# EAGLE design ds-8_clone_v1.1 (EAGLE 5.10)
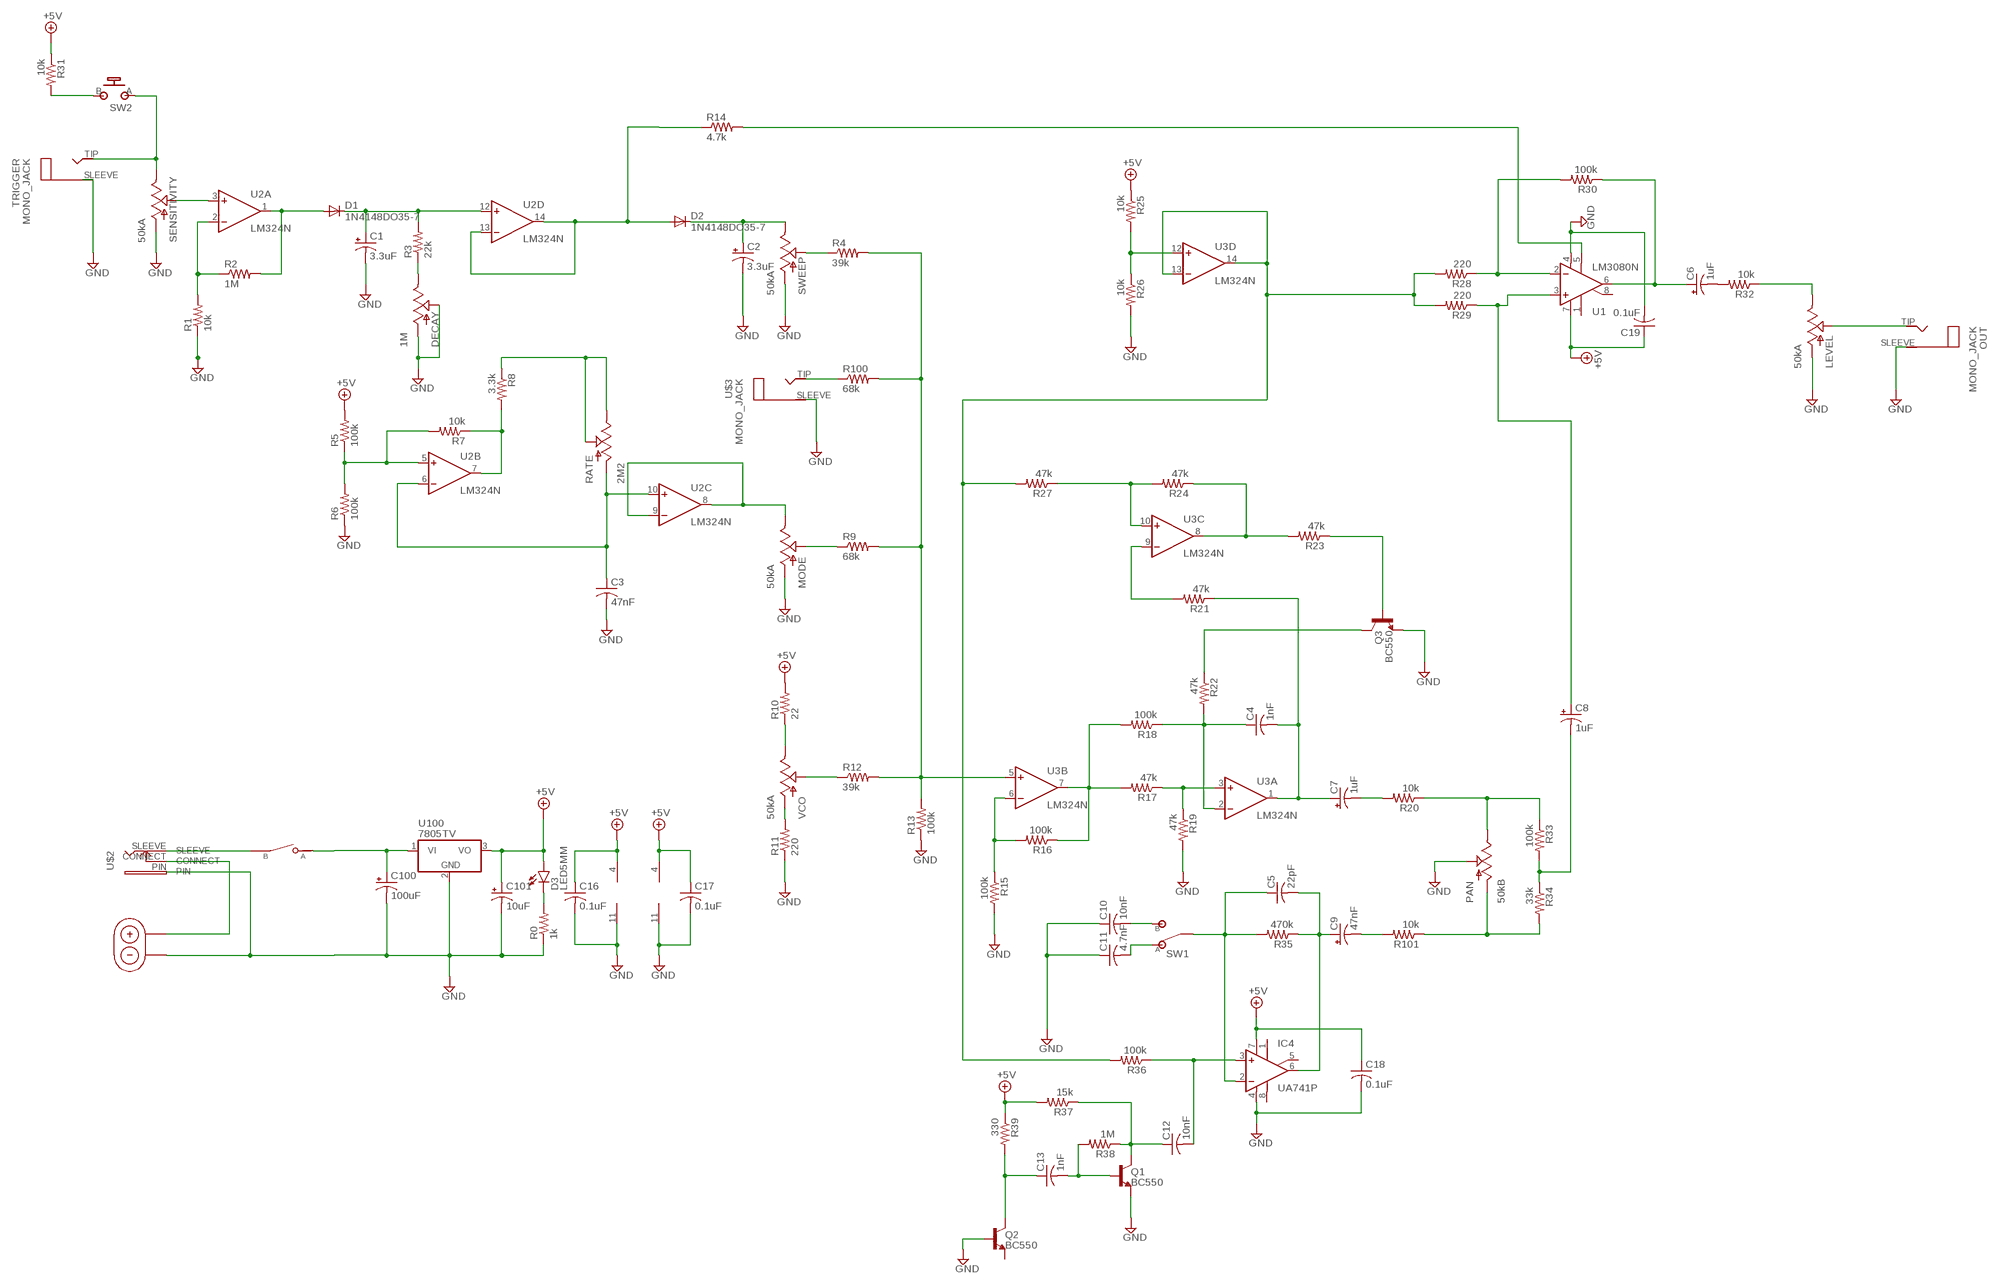
[diagram p0: schematic, sheet 1]

## Parts
C1  3.3uF  0501  [050_020_1]
C2  3.3uF  0501  [050_020_1]
C3  47nF  C-US050-035X075  [C050-035X075]
C4  1nF  C-US050-035X075  [C050-035X075]
C5  22pF  C-US050-035X075  [C050-035X075]
C6  1uF  0501  [050_020_1]
C7  1uF  080  [080_035]
C8  1uF  080  [080_035]
C9  47nF  080  [080_035]
C10  10nF  C-US050-035X075  [C050-035X075]
C11  4.7nF  C-US050-035X075  [C050-035X075]
C12  10nF  C-US050-035X075  [C050-035X075]
C13  1nF  C-US050-035X075  [C050-035X075]
C16  0.1uF  C-US050-035X075  [C050-035X075]
C17  0.1uF  C-US050-035X075  [C050-035X075]
C18  0.1uF  C-US050-035X075  [C050-035X075]
C19  0.1uF  C-US050-035X075  [C050-035X075]
C100  100uF  080  [080_035]
C101  10uF  080  [080_035]
D1  1N4148DO35-7  [DO35-7]
D2  1N4148DO35-7  [DO35-7]
D3  LED5MM  [LED5MM]
DECAY  1M  POT-RV16AF-20  [POT_ALPHA_RV16AF-20]
IC4  UA741P  [DIL08]
LEVEL  50kA  POT-RV16AF-20  [POT_ALPHA_RV16AF-20]
MODE  50kA  POT-RV16AF-20  [POT_ALPHA_RV16AF-20]
OUT  MONO_JACK  [MONO_JACK]
PAN  50kB  POT-RV16AF-20  [POT_ALPHA_RV16AF-20]
Q1  BC550  [TO92-]
Q2  BC550  [TO92-]
Q3  BC550  [TO92-]
R0  1k  RESISTOR  [RESISTOR]
R1  10k  RESISTOR  [RESISTOR]
R2  1M  RESISTOR  [RESISTOR]
R3  22k  RESISTOR  [RESISTOR]
R4  39k  RESISTOR  [RESISTOR]
R5  100k  RESISTOR  [RESISTOR]
R6  100k  RESISTOR  [RESISTOR]
R7  10k  RESISTOR  [RESISTOR]
R8  3.3k  RESISTOR  [RESISTOR]
R9  68k  RESISTOR  [RESISTOR]
R10  22  RESISTOR  [RESISTOR]
R11  220  RESISTOR  [RESISTOR]
R12  39k  RESISTOR  [RESISTOR]
R13  100k  RESISTOR  [RESISTOR]
R14  4.7k  RESISTOR  [RESISTOR]
R15  100k  RESISTOR  [RESISTOR]
R16  100k  RESISTOR  [RESISTOR]
R17  47k  RESISTOR  [RESISTOR]
R18  100k  RESISTOR  [RESISTOR]
R19  47k  RESISTOR  [RESISTOR]
R20  10k  RESISTOR  [RESISTOR]
R21  47k  RESISTOR  [RESISTOR]
R22  47k  RESISTOR  [RESISTOR]
R23  47k  RESISTOR  [RESISTOR]
R24  47k  RESISTOR  [RESISTOR]
R25  10k  RESISTOR  [RESISTOR]
R26  10k  RESISTOR  [RESISTOR]
R27  47k  RESISTOR  [RESISTOR]
R28  220  RESISTOR  [RESISTOR]
R29  220  RESISTOR  [RESISTOR]
R30  100k  RESISTOR  [RESISTOR]
R31  10k  RESISTOR  [RESISTOR]
R32  10k  RESISTOR  [RESISTOR]
R33  100k  RESISTOR  [RESISTOR]
R34  33k  RESISTOR  [RESISTOR]
R35  470k  RESISTOR  [RESISTOR]
R36  100k  RESISTOR  [RESISTOR]
R37  15k  RESISTOR  [RESISTOR]
R38  1M  RESISTOR  [RESISTOR]
R39  330  RESISTOR  [RESISTOR]
R100  68k  RESISTOR  [RESISTOR]
R101  10k  RESISTOR  [RESISTOR]
RATE  2M2  POT-RV16AF-20  [POT_ALPHA_RV16AF-20]
SENSITIVITY  50kA  POT-RV16AF-20  [POT_ALPHA_RV16AF-20]
SW1  SPDT_SWITCH  [SPDT_TOGGLE_SWITCH]
SW2  MOMENTARY_SW  [MOMENTARY_SW]
SW3  SPST_SWITCH  [SPST_TOGGLE_SWITCH]
SWEEP  50kA  POT-RV16AF-20  [POT_ALPHA_RV16AF-20]
TRIGGER  MONO_JACK  [MONO_JACK]
U1  LM3080N  [DIL08]
U2  LM324N  [DIL14]
U3  LM324N  [DIL14]
U100  7805TV  [TO220V]
U$1  9V_BATTERY_CLIP  [9V_BATTERY]
U$2  DC_JACK_OFFBOARD  [DC_JACK_OFFBOARD]
U$3  MONO_JACK  [MONO_JACK]
VCO  50kA  POT-RV16AF-20  [POT_ALPHA_RV16AF-20]

## Nets
+9V: C16.1 C17.1 C18.1 C19.1 C101.+ D3.A IC4.7(V+) R5.2 R10.2 R25.1 R31.1 R37.2 R39.1 U1.7(V+) U2.4(P:V+) U3.4(P:V+) U100.3(VO) ; supply symbol labelled +5V
C5: C5.1 IC4.2(-IN) R35.2 SW1.C(COM)
GND: C1.- C2.- C3.2 C10.1 C11.1 C16.2 C17.2 C18.2 C19.2 C100.- C101.- DECAY.1(A) DECAY.2(S) IC4.4(V-) LEVEL.1(A) MODE.1(A) OUT.SLEEVE PAN.2(S) Q1.1(E) Q2.2(B) Q3.1(E) R0.1 R1.1 R6.1 R11.1 R13.1 R15.2 R19.2 R26.2 SENSITIVITY.1(A) SWEEP.1(A) TRIGGER.SLEEVE U1.4(V-) U2.11(P:V-) U3.11(P:V-) U100.2(GND) U$1.9V_BATTERY_- U$2.PIN U$3.SLEEVE
N$1: SENSITIVITY.3(E) SW2.A(P) TRIGGER.TIP
N$2: SW3.B U$2.SLEEVE
N$3: SENSITIVITY.2(S) U2.3(A:+IN)
N$4: U$1.9V_BATTERY_+ U$2.CONNECT
N$5: R1.2 R2.1 U2.2(A:-IN)
N$6: D1.A R2.2 U2.1(A:OUT)
N$7: C1.+ D1.C R3.2 U2.12(D:+IN)
N$8: R31.2 SW2.B(S)
N$9: DECAY.3(E) R3.1
N$10: D2.A R14.1 U2.13(D:-IN) U2.14(D:OUT)
N$11: R14.2 U1.5(OPT)
N$12: R4.1 SWEEP.2(S)
N$13: R25.2 R26.1 U3.12(D:+IN)
N$14: R28.1 R30.2 U1.2(-IN)
N$15: C8.+ R29.1 U1.3(+IN)
N$16: R27.2 R28.2 R29.2 R36.2 U3.13(D:-IN) U3.14(D:OUT)
N$17: R100.1 U$3.TIP
N$18: C6.+ R30.1 U1.6(OUT)
N$19: R4.2 R9.2 R12.2 R13.2 R100.2 U3.5(B:+IN)
N$20: MODE.2(S) R9.1
N$21: R11.2 VCO.1(A)
N$22: R12.1 VCO.2(S)
N$23: C2.+ D2.C SWEEP.3(E)
N$24: R5.1 R6.2 R7.2 U2.5(B:+IN)
N$25: LEVEL.3(E) R32.1
N$26: R7.1 R8.2 U2.7(B:OUT)
N$27: LEVEL.2(S) OUT.TIP
N$28: R10.1 VCO.3(E)
N$29: R15.1 R16.2 U3.6(B:-IN)
N$30: R16.1 R17.2 R18.2 U3.7(B:OUT)
N$31: R17.1 R19.1 U3.3(A:+IN)
N$32: C4.1 R18.1 R22.2 U3.2(A:-IN)
N$33: C4.2 C7.+ R21.1 U3.1(A:OUT)
N$34: C7.- R20.2
N$35: PAN.3(E) R20.1 R33.1
N$36: C8.- R33.2 R34.1
N$37: MODE.3(E) U2.8(C:OUT) U2.9(C:-IN)
N$38: C9.- R101.2
N$39: C5.2 C9.+ IC4.6(OUT) R35.1
N$40: D3.K(C) R0.2
N$41: C10.2 SW1.B
N$42: C12.2 IC4.3(+IN) R36.1
N$43: C11.2 SW1.A
N$44: C12.1 Q1.3(C) R37.1 R38.1
N$45: C100.+ SW3.A U100.1(VI)
N$46: C13.2 Q1.2(B) R38.2
N$47: C13.1 Q2.3(C) R39.2
N$48: Q3.3(C) R22.1
N$49: R21.2 U3.9(C:-IN)
N$50: Q3.2(B) R23.1
N$51: R23.2 R24.1 U3.8(C:OUT)
N$52: R24.2 R27.1 U3.10(C:+IN)
N$53: C6.- R32.2
N$55: R8.1 RATE.2(S) RATE.3(E)
N$56: C3.1 RATE.1(A) U2.6(B:-IN) U2.10(C:+IN)
R34: PAN.1(A) R34.2 R101.1
Unconnected: IC4.1(ON1) IC4.5(ON2) IC4.8(OPT) Q2.1(E) U1.1(ON1) U1.8(ON2)

## Library data of the parts
C1 C2 C6 = gm-caps-electro-pol:050: 0.22 - 100uF Xicon values at Mouser.com: 10V: 10 - 100uF; 16V: 2.2 - 47uF; 25V: 0.47 - 47uF; 50V: 0.22 - 22uF
C3-C5 C10-C13 C16-C19 = resistor:C-US: CAPACITOR, American symbol
C7-C9 C100 C101 = gm-caps-electro-pol:080: 47 - 470uF Xicon values at Mouser.com 10V: 330, 470uF; 16V: 220, 330uF; 25V: 220uF; 50V: 47, 100uF
D1 D2 = diode:1N4148: DIODE high speed (Philips)
D3 = gm-diodes:LED
DECAY LEVEL MODE PAN RATE SENSITIVITY SWEEP VCO = SparkFun:POT
IC4 = linear:*741: OP AMP
OUT TRIGGER U$3 = 00_steve:MONO_JACK
Q1-Q3 = gm-trans:BC550
R0 R1-R39 R100 R101 = 00_steve:RESISTOR
SW1 = 00_steve:SPDT_SWITCH: SPDT Switch Part No.: M102 Source: (http://www.led-switch.com)
SW2 = 00_steve:MOMENTARY_SW
SW3 = 00_steve:SPST_SWITCH: SPST Switch Part No.: M101 Source: (http://www.led-switch.com)
U1 = gm-ics:*3080: OP AMP
U2 U3 = linear:LM324: OP AMP
U100 = linear:78*: Positive VOLTAGE REGULATOR Source: http://cache.national.com/ds/LM/LM78L05.pdf http://www.fairchildsemi.com/ds/LM/LM7805.pdf
U$1 = 00_steve:9V_BATTERY_CLIP
U$2 = 00_steve:DC_JACK_OFFBOARD

## Board
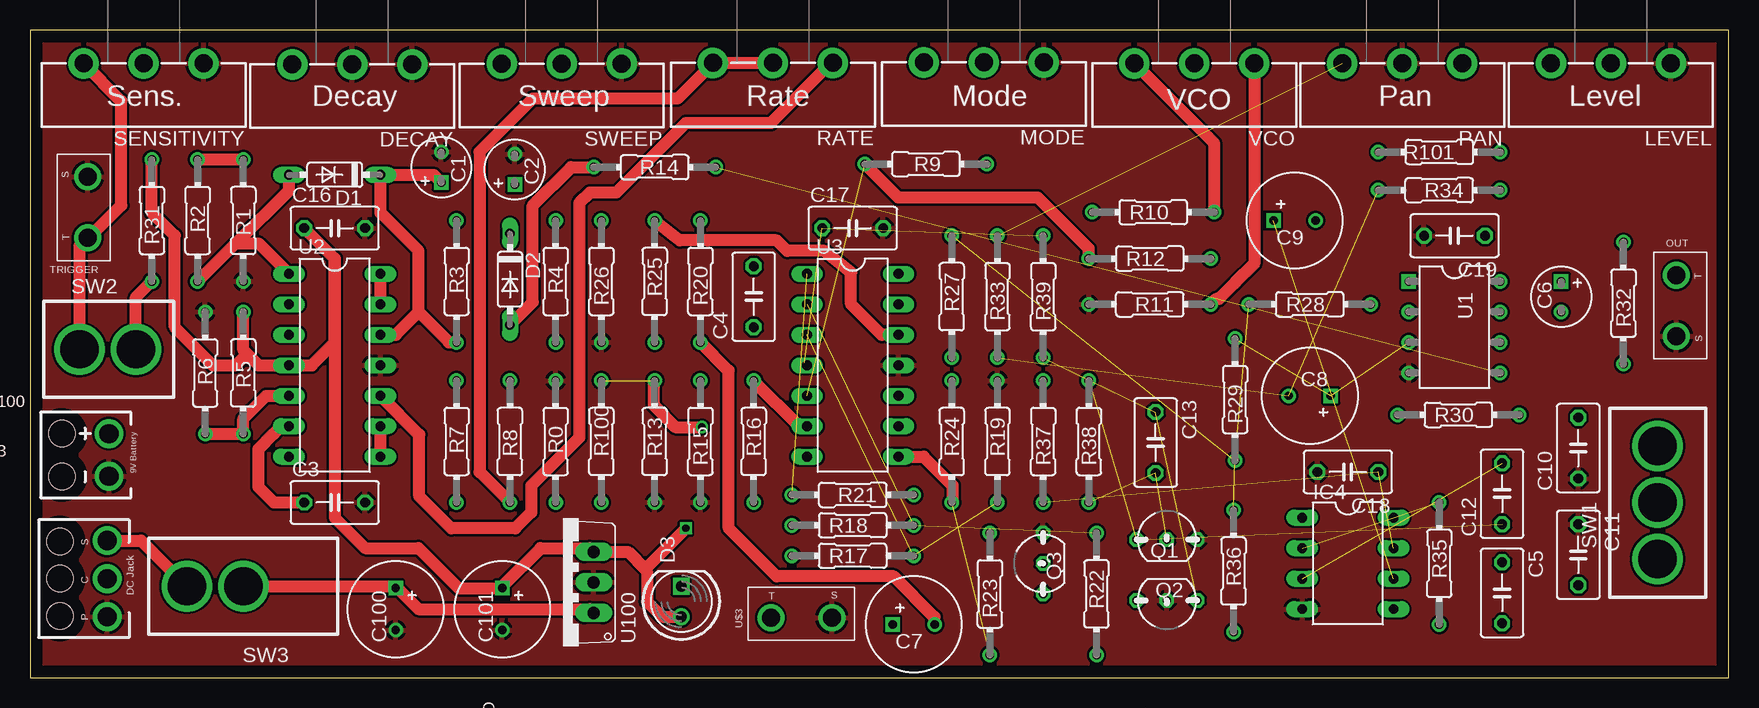
[diagram p1: board, top side]
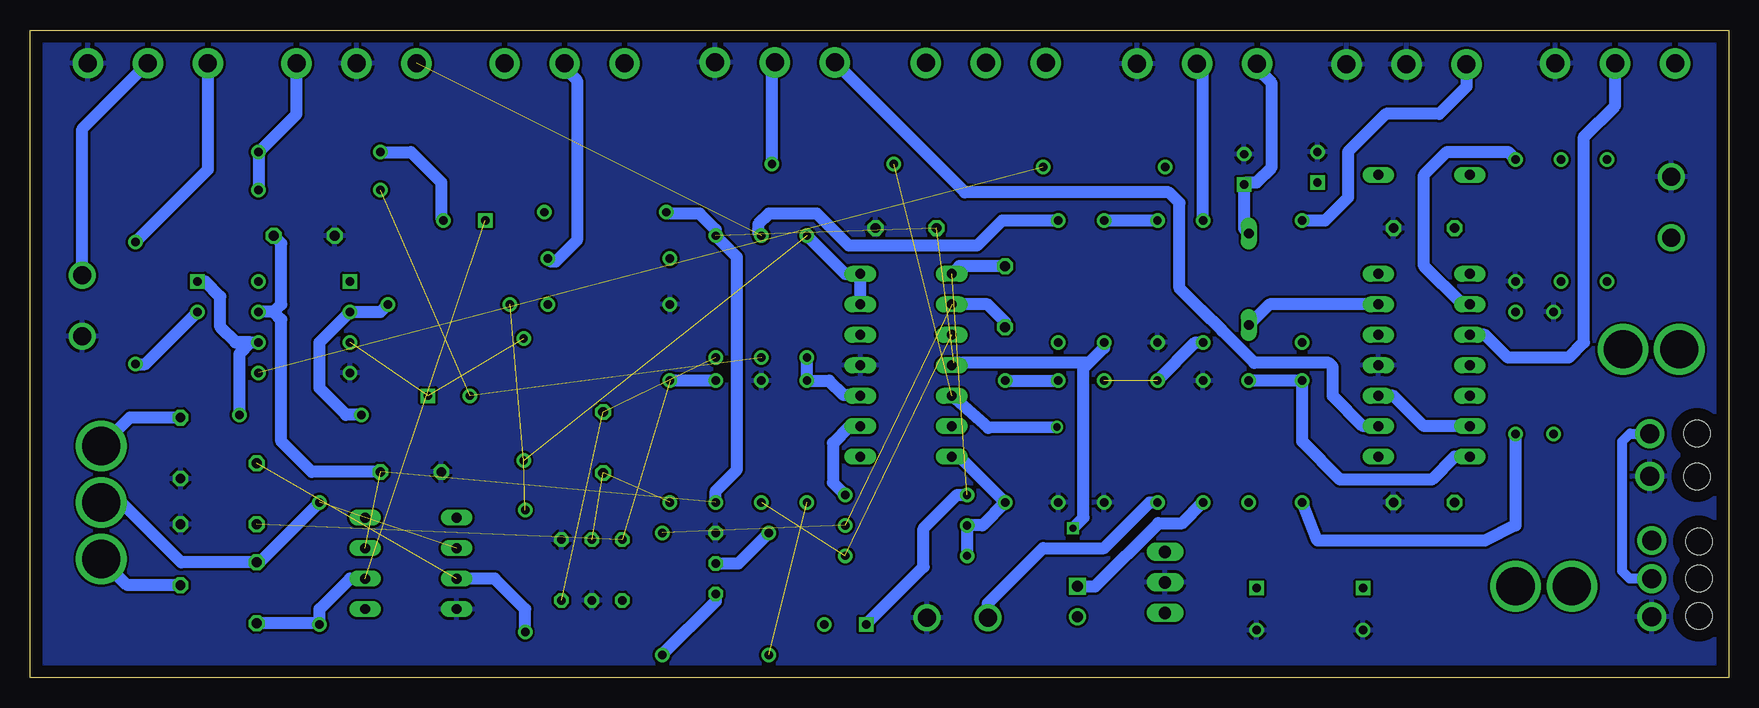
[diagram p2: board, bottom side, seen from below]

Size 141.6 x 53.98 mm. Coordinates in mm from the lower left corner, seen from the top.
Outline: 0,0 141.6,0 141.6,53.98 0,53.98 0,0
Copper layers (1*16): Top 0.035mm / dielectric 1.5mm / Bottom 0.035mm
Design rules "default": minimum track width 10mil, minimum drill 24mil, track to track 8mil, track to pad 8mil, pad to pad 8mil, via to via 8mil, smd to smd 8mil, copper to edge 40mil, drill to drill 8mil, minimum pad ring 10mil, minimum via ring 8mil, stop-mask expansion 4mil, vias tented up to drill 0mil, thermal gap 10mil

### Footprints (pad centres in the part's own frame; a part is rotated, then mirrored left to right if it is on the bottom)
050_020_1 = drill 0.7 square: + -1.27,0 | drill 0.7 round: - 1.27,0
C050-035X075 = drill 0.813 octagon: 1 -2.54,0; 2 2.54,0
080_035 = drill 0.7 square: + -1.75,0 | drill 0.7 round: - 1.75,0
DO35-7 = drill 0.813 long: A 3.81,0; C -3.81,0
LED5MM = drill 0.9 round: A -1.27,0 | drill 0.9 square: K 1.27,0
POT_ALPHA_RV16AF-20 = drill 1.5 pad 2.54 round: 1 -5,0; 2 0,0; 3 5,0
DIL08 = drill 0.813 long: 1 -3.81,-3.81; 2 -1.27,-3.81; 3 1.27,-3.81; 4 3.81,-3.81; 5 3.81,3.81; 6 1.27,3.81; 7 -1.27,3.81; 8 -3.81,3.81
MONO_JACK = drill 1.5 round: SLEEVE 2.54,0; TIP -2.54,0
TO92- = drill 0.7 octagon: 1 2.54,0; 2 0,0; 3 -2.54,0
RESISTOR = drill 0.7 round: 1 -5.08,0; 2 5.08,0
SPDT_TOGGLE_SWITCH = drill 3.2 round: A -4.7,0; B 4.7,0; C 0,0
MOMENTARY_SW = drill 3.2 round: A -2.223,0.064; B 2.478,0.064
SPST_TOGGLE_SWITCH = drill 3.2 round: A 0,0; B 4.7,0
DIL08' = drill 0.7 square: 1 -3.81,-3.81 | drill 0.7 round: 2 -1.27,-3.81; 3 1.27,-3.81; 4 3.81,-3.81; 5 3.81,3.81; 6 1.27,3.81; 7 -1.27,3.81; 8 -3.81,3.81
DIL14 = drill 0.813 long: 1 -7.62,-3.81; 2 -5.08,-3.81; 3 -2.54,-3.81; 4 0,-3.81; 5 2.54,-3.81; 6 5.08,-3.81; 7 7.62,-3.81; 8 7.62,3.81; 9 5.08,3.81; 10 2.54,3.81; 11 0,3.81; 12 -2.54,3.81; 13 -5.08,3.81; 14 -7.62,3.81
TO220V = drill 1.016 long: 1 -2.54,-2.54; 2 0,-2.54; 3 2.54,-2.54
9V_BATTERY = drill 1.6 round: 9V_BATTERY_+ -1.778,1.27; 9V_BATTERY_- 1.778,1.27 | hole 2.2: -1.778,-2.667; 1.778,-2.667
DC_JACK_OFFBOARD = drill 1.6 round: CONNECT 0,1.27; PIN 3.175,1.27; SLEEVE -3.175,1.27 | hole 2.2: -3.111,-2.667; 0,-2.667; 3.111,-2.667

### Placement (x,y rotation side)
C1  34.29,42.55 90 top
C2  40.41,42.35 90 top
C3  25.4,14.61 0 top
C4  60.33,31.75 90 top
C5  122.71,7.07 270 top
C6  127.64,31.75 270 top
C7  73.66,4.45 0 top
C8  106.68,23.5 180 top
C9  105.41,38.1 0 top
C10  129.06,19.14 90 top
C11  129.06,10.25 270 top
C12  122.71,15.33 90 top
C13  93.82,19.6 270 top
C16  25.4,37.47 0 top
C17  68.58,37.47 0 top
C18  109.86,17.14 180 top
C19  118.75,36.83 180 top
C100  30.48,5.71 270 top
C101  39.37,5.71 270 top
D1  25.4,41.91 180 top
D2  40.01,33.2 270 top
D3  54.29,6.35 90 top
DECAY  26.87,51.12 180 top
IC4  109.86,9.53 270 top
LEVEL  131.78,51.2 180 top
MODE  79.51,51.29 180 top
OUT  137.25,31.01 270 top
PAN  114.39,51.2 180 top
Q1  94.77,11.52 0 top
Q2  94.77,6.44 180 top
Q3  84.45,9.53 90 top
R0  43.81,19.68 270 top
R1  17.78,38.1 90 top
R2  13.97,38.1 270 top
R3  35.56,33.02 270 top
R4  43.81,33.02 270 top
R5  17.78,25.4 90 top
R6  14.61,25.4 270 top
R7  35.56,19.68 270 top
R8  40.01,19.68 90 top
R9  74.67,42.81 180 top
R10  93.64,38.79 180 top
R11  93.34,31.11 0 top
R12  93.34,34.92 180 top
R13  52.07,19.68 90 top
R14  52.07,42.55 0 top
R15  55.88,19.68 270 top
R16  60.33,19.68 90 top
R17  68.58,10.16 180 top
R18  68.58,12.7 180 top
R19  80.64,19.68 90 top
R20  55.88,33.02 270 top
R21  68.58,15.24 0 top
R22  88.9,6.99 90 top
R23  80.01,6.99 270 top
R24  76.83,19.68 90 top
R25  52.07,33.02 90 top
R26  47.62,33.02 270 top
R27  76.83,31.75 90 top
R28  106.68,31.11 180 top
R29  100.46,23.18 270 top
R30  119.06,21.91 180 top
R31  10.16,38.1 270 top
R32  132.82,31.21 270 top
R33  80.64,31.75 270 top
R34  117.47,40.63 0 top
R35  117.47,9.53 90 top
R36  100.33,8.89 90 top
R37  84.45,19.68 270 top
R38  88.27,19.68 270 top
R39  84.45,31.75 270 top
R100  47.62,19.68 90 top
R101  117.47,43.8 180 top
RATE  61.94,51.23 180 top
SENSITIVITY  9.48,51.19 180 top
SW1  135.67,14.59 90 top
SW2  6.35,27.3 0 top
SW3  17.78,7.62 180 top
SWEEP  44.32,51.17 180 top
TRIGGER  4.8,39.19 90 top
U1  LM3080N  [DIL08']  118.75,29.21 270 top
U2  25.4,26.04 270 top
U3  68.58,26.04 270 top
U100  44.45,7.94 90 top
U$1  5.32,18.56 270 top
U$2  5.16,8.25 270 top
U$3  64.29,5.01 0 top
VCO  97.04,51.19 180 top

### Tracks (layer width: path | path; a pad name or v marks a point on that pad's centre or on a via)
+9V  (via drill 0.6)  (4 unrouted)
  Top 1.016: 51.28,9.05 49.85,10.48 U100.3 46.67,10.79 42.55,10.79 39.37,7.62 C101.+ 35.72,7.46 32.38,10.79 27.94,10.79 25.4,13.34 25.4,34.92 | 51.28,9.05 51.44,8.89 51.44,6.35 52.7,5.08 D3.A | 25.4,34.92 C16.1 25.4,34.92 | 25.4,34.92 25.4,27.94 23.5,26.04 U2.4 19.05,26.04 18.1,26.99 | 18.1,26.99 17.78,27.3 R5.2 | R31.1 10.16,38.73 12.06,36.83 12.06,29.21 15.24,26.04 17.14,26.04 18.1,26.99 | v54.67,12.45 | 51.28,9.05 v54.67,12.45
  Bottom 1.016: 121.28,30.48 U1.7 | 121.28,30.48 120.65,31.11 120.65,36.2 C19.1 | C18.1 118.11,17.14 120.02,19.05 120.65,19.68 120.65,29.84 121.28,30.48 | 52.07,27.5 R25.1 52.07,27.5 | 53.34,26.23 52.07,27.5 | 53.34,26.23 64.58,26.23 U3.4 | 53.34,26.23 52.07,27.5 | 53.34,26.23 53.78,25.78 53.78,13.34 v54.67,12.45 | R10.2 88.44,38.67 85.79,38.67 84.45,37.34 R39.1 82.68,35.05 82.68,17.34 83.12,16.89 84.45,15.56 R37.2
C5  (1 unrouted)
  Bottom 1.016: SW1.C 135.02,15.24 134.62,15.24 128.99,9.61 C5.1 122.47,9.61 R35.2
GND
  pour Bottom: 0,62.23 141.6,62.23 141.6,0 0,0
  pour Top: 0,62.23 141.6,62.23 141.6,0 0,0
N$1
  Top 1.016: SW2.A 4.13,35.98 TRIGGER.TIP 4.9,36.65 7.62,39.37 7.62,48.05 SENSITIVITY.3
N$2
  Top 1.016: U$2.SLEEVE 9.27,11.43 SW3.B
N$3
  Bottom 1.016: SENSITIVITY.2 9.47,47.67 12.06,45.09 12.06,27.94 13.34,26.67 18.41,26.67 20.32,28.57 U2.3
N$4
  Bottom 0.813: U$1.9V_BATTERY_+ 8.24,20.34 8.89,19.68 8.89,8.89 8.26,8.26 U$2.CONNECT | U$2.CONNECT
N$5
  Top 1.016: R1.2 R2.1
  Bottom 1.016: U2.2 22.23,31.11 25.4,34.29 25.4,41.91 23.5,43.81 18.41,43.81 R1.2
N$6
  Top 1.016: R2.2 17.14,36.2 | 17.14,36.2 19.05,36.2 U2.1 | D1.A 21.59,40.64 17.14,36.2
N$7
  Top 1.016: C1.+ 33.66,41.91 D1.C 29.21,38.73 32.38,35.56 32.38,30.48 | 32.38,30.48 30.48,28.57 U2.12 | R3.2 34.92,27.94 32.38,30.48
N$8
  Top 1.016: SW2.B 8.83,31.69 R31.2
N$9
  Bottom 1.016: DECAY.3 21.87,49.25 24.13,46.99 28.57,46.99 31.75,43.81 31.75,40.01 33.66,38.1 R3.1
N$10
  Top 1.016: U2.13 U2.14 | R14.1 45.09,42.55 41.91,39.37 41.91,31.3 D2.A
  Bottom 1.016: U2.13 38.28,31.11 D2.A
N$11  (1 unrouted)
N$12
  Bottom 1.016: R4.1 43.81,50.67 SWEEP.2
N$13
  Top 1.016: U3.12 70.99,28.57 68.45,31.11 68.45,33.78 66.23,35.56 63.12,35.56 62.23,36.45 56.45,36.45 56.01,36.45 54.17,36.45 R25.2
  Bottom 1.016: R26.1 R25.2
N$14
  Bottom 1.016: R30.2 115.25,21.91 117.47,24.13 117.47,27.94 U1.2 112.39,30.48 R28.1
N$15  (2 unrouted)
N$16  (3 unrouted)
  Bottom 1.016: U3.13 U3.14 73.66,33.66 R27.2
N$17
  Bottom 1.016: U$3.TIP 61.75,6.19 57.15,10.79 52.07,10.79 48.26,14.61 R100.1
N$18
  Bottom 1.016: C6.+ 127,33.02 125.73,31.75 125.73,29.21 124.46,27.94 123.19,27.94 | 123.19,27.94 U1.6 | R30.1 124.14,26.99 123.19,27.94
N$19  (via drill 0.6)  (2 unrouted)
  Top 1.016: v56.01,20.89 53.78,20.89 52.01,22.67 52.01,24.7 R13.2 | R12.2 88.27,35.75 84.01,40.01 72.39,40.01 R9.2
  Bottom 1.016: R4.2 44.45,27.94 R100.2 | U3.5 61.72,20.83 v56.01,20.89
N$20
  Bottom 1.016: R9.1 79.75,51.05 MODE.2
N$21
  Top 1.016: VCO.1 102.04,34.48 100.46,32.89 99.12,31.56 98.87,31.56 R11.2
N$22
  Bottom 1.016: VCO.2 97.04,50.81 96.01,49.78 96.01,36.45 97.79,34.67 98.17,34.67 R12.1
N$23
  Bottom 1.016: SWEEP.3 39.32,50.75 38.1,49.53 38.1,42.55 39.37,41.27 40.22,41.27 C2.+ 40.41,37.41 D2.C
N$24
  Top 1.016: R6.2 R5.1 | R5.1 17.78,21.59 | 17.78,21.59 18.41,22.23 | 18.41,22.23 19.68,23.5 | 19.68,23.5 U2.5 19.68,23.5 | 18.41,22.23 19.68,23.5 | 17.78,21.59 18.41,22.23 | R5.1 17.78,21.59
  Bottom 1.016: R7.2 34.29,11.43 33.02,11.43 30.48,11.43 20.32,11.43 17.78,12.7 17.78,19.05 R5.1
N$25
  Bottom 1.016: LEVEL.3 126.78,42.33 R32.1
N$26
  Bottom 1.016: R8.2 R7.1 35.56,19.68 32.38,16.51 24.77,16.51 22.86,18.41 U2.7
N$27
  Bottom 1.016: OUT.TIP 137.25,45.74 LEVEL.2
N$28
  Top 1.016: R10.1 98.72,44.52 VCO.3
N$29
  Top 1.016: U3.6 64.14,20.95 R16.2
  Bottom 1.016: R16.2 R15.1
N$30
  Bottom 1.016: R17.2 R18.2 62.23,12.7 R16.1 64.14,18.41 U3.7
N$31  (2 unrouted)
N$32  (2 unrouted)
  Bottom 1.016: C4.1 60.33,29.65 61.78,31.11 U3.2
N$33  (1 unrouted)
  Bottom 1.016: R21.1 64.33,15.24 67.12,12.45 67.12,9.24 C7.+ | C4.2 64.14,34.29 U3.1
N$34
  Top 1.016: C7.- 75.41,5.04 72.01,8.45 62.23,8.45 58.23,12.45 58.23,25.59 R20.2
N$35  (1 unrouted)
  Bottom 1.016: R20.1 60.58,38.1 62.67,36.01 73.34,36.01 75.56,38.23 76.01,38.67 80.01,38.67 80.9,37.78 80.9,37.08 R33.1
N$36  (2 unrouted)
N$37
  Top 1.016: U2.8 U2.9
  Bottom 1.016: U2.9 30.48,20.95 33.02,23.5 33.02,25.91 33.34,26.23 39.56,26.23 42.23,28.89 44.01,30.67 45.78,32.45 45.78,39.56 46.67,40.45 63.67,40.45 MODE.3
N$38
  Bottom 1.016: R101.2 109.84,43.8 107.31,41.27 107.31,38.26 C9.-
N$39  (1 unrouted)
  Bottom 1.016: C5.2 117.56,4.53 R35.1 117.47,5.71 114.94,8.26 IC4.6
N$40
  Bottom 1.016: D3.K 52.83,7.62 47.56,12.89 45.53,12.89 R0.2
N$41
  Bottom 1.016: C10.2 133.28,21.68 SW1.B
N$42  (1 unrouted)
  Bottom 1.016: R36.1 100.33,5.71 102.87,8.26 IC4.3
N$43
  Bottom 1.016: C11.2 133.48,7.71 SW1.A
N$44  (2 unrouted)
  Bottom 1.016: R37.1 R38.1
N$45
  Top 1.016: SW3.A 30.32,7.62 C100.+ 30.64,7.46 32.38,5.71 46.67,5.71 U100.1
N$46  (2 unrouted)
N$47  (2 unrouted)
N$48
  Bottom 1.016: Q3.3 84.45,6.35 R22.1
N$49
  Bottom 1.016: U3.9 73.28,20.95 74.68,19.56 74.68,16.26 R21.2
N$50
  Bottom 1.016: Q3.2 82.55,9.53 R23.1
N$51  (1 unrouted)
  Top 1.016: U3.8 74.49,18.41 76.9,16 76.9,14.67 R24.1
N$52
  Bottom 1.016: R27.1 R24.2 74.99,24.77 73.79,23.56 72.45,23.56 U3.10
N$53
  Bottom 1.016: R32.2 131.98,26.13 C6.-
N$55
  Top 1.016: RATE.2 RATE.3 53.98,48.26 41.91,48.26 37.47,43.81 37.47,17.14 R8.1
N$56
  Top 1.016: C3.1 20.32,14.61 19.05,15.88 19.05,19.05 20.32,20.32 20.95,20.95 U2.6 | RATE.1 66.79,51.23 61.78,46.23 54.67,46.23 48.9,40.45 46.67,40.45 45.78,39.56 45.78,20 41.78,16 41.78,13.78 40.45,12.45 35.12,12.45 32.45,15.11 32.45,20.26 U2.10
  Bottom 1.016: U2.6 25.4,20.95 27.94,23.5 U2.10
R34
  Bottom 1.016: PAN.1 119.39,46.97 R101.1 R34.2

### Text on the board
tPlace: Q2 | C3 | Sens. | Decay | Sweep | Rate | Mode | Pan | Level | VCO | Q1 | C9 | C8 | U2 | U100 | U3 | C4 | U1 | U4 | LED | Q3 | R35 | + | C6